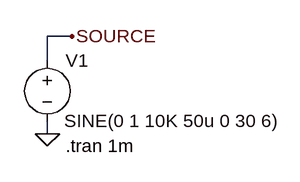
[diagram p0: schematic Fig_2-34_V-source-SINE.asc]
Fig_2-34_V-source-SINE.asc, the LTspice schematic file:
Version 4
SHEET 1 880 680
WIRE 144 80 112 80
WIRE 112 112 112 80
WIRE 112 208 112 192
FLAG 112 208 0
FLAG 144 80 SOURCE
SYMBOL voltage 112 96 R0
WINDOW 3 22 95 Left 2
WINDOW 123 0 0 Left 2
WINDOW 39 0 0 Left 2
SYMATTR Value SINE(0 1 10K 50u 0 30 6)
SYMATTR InstName V1
TEXT 136 224 Left 2 !.tran 1m

The netlist it stands for:
* Fig_2-34_V-source-SINE.asc
V1 SOURCE 0 SINE(0 1 10K 50u 0 30 6)
.tran 1m
.backanno
.end